# EAGLE design mimic4688 (EAGLE 7.5.0)
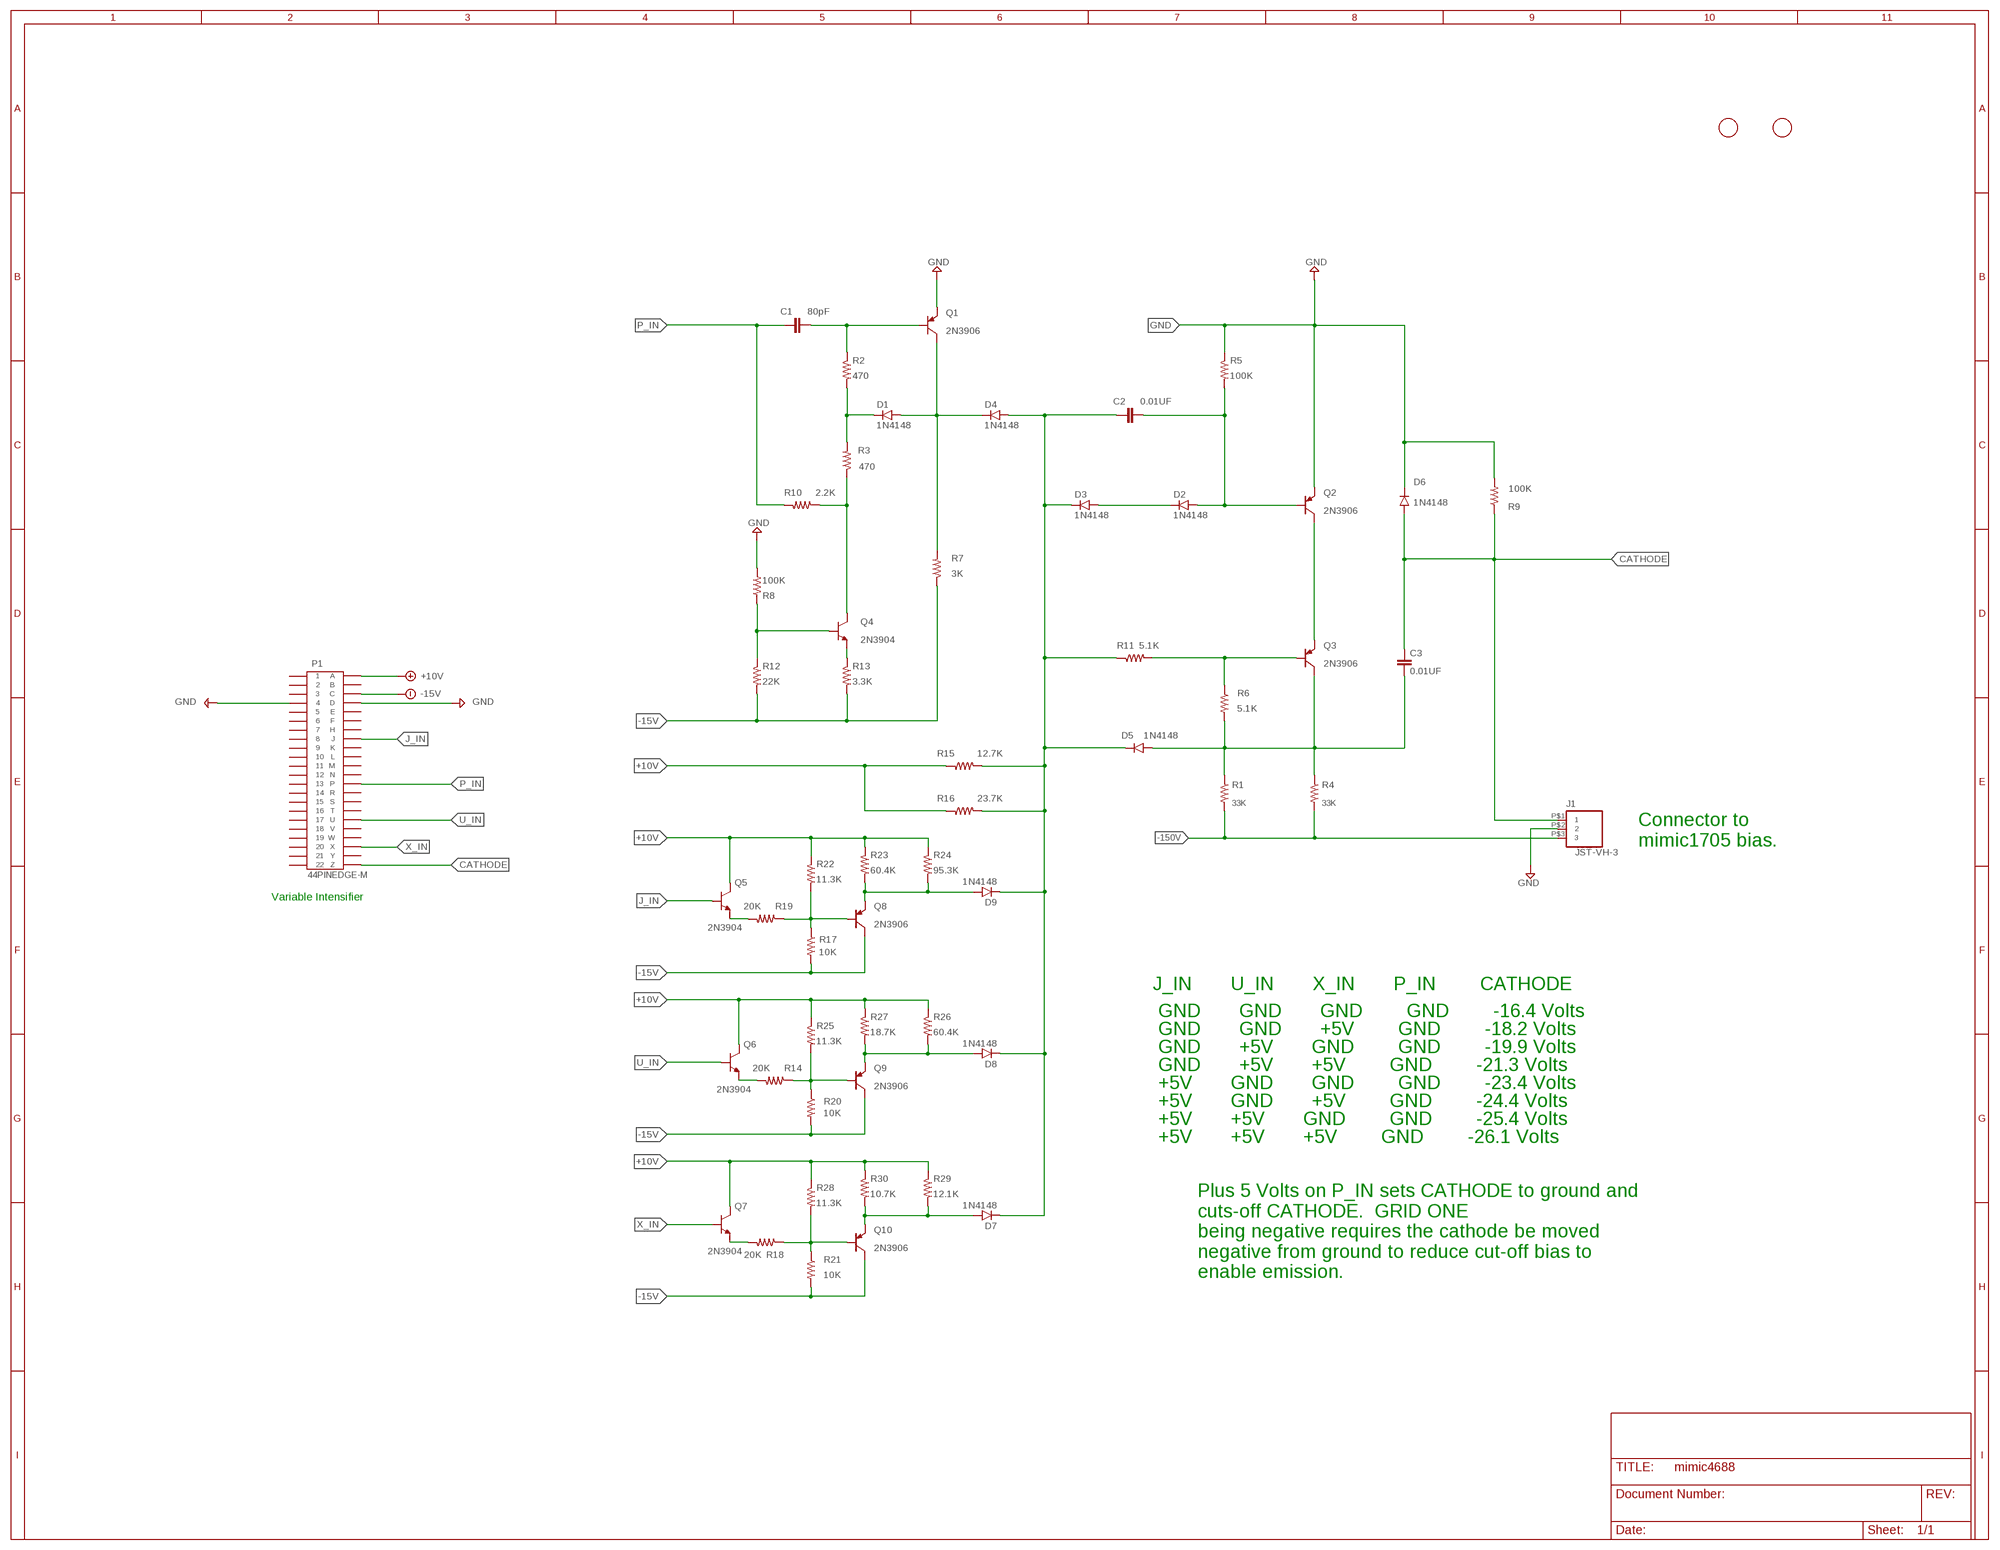
[diagram p0: schematic, sheet 1]

## Parts
C1  80pF  CAP_5MM  [5MM_TH]
C2  0.01UF  CAP_5MM  [5MM_TH]
C3  0.01UF  CAP_5MM  [5MM_TH]
D1  1N4148  [DO35-7]
D2  1N4148  [DO35-7]
D3  1N4148  [DO35-7]
D4  1N4148  [DO35-7]
D5  1N4148  [DO35-7]
D6  1N4148  [DO35-7]
D7  1N4148  [DO35-7]
D8  1N4148  [DO35-7]
D9  1N4148  [DO35-7]
J1  JST-VH-3  [VHR-3N]
P1  44PINEDGE-M  [44PINEDGE]
Q1  2N3906  [TO92]
Q2  2N3906  [TO92]
Q3  2N3906  [TO92]
Q4  2N3904  [TO92]
Q5  2N3904  [TO92]
Q6  2N3904  [TO92]
Q7  2N3904  [TO92]
Q8  2N3906  [TO92]
Q9  2N3906  [TO92]
Q10  2N3906  [TO92]
R1  33K  RES33K2W  [RR02]
R2  470  R-1/4WATT  [0207/10]
R3  470  R-1/4WATT  [0207/10]
R4  33K  RES33K2W  [RR02]
R5  100K  R-1/4WATT  [0207/10]
R6  5.1K  R-1/4WATT  [0207/10]
R7  3K  R-1/4WATT  [0207/10]
R8  100K  R-1/4WATT  [0207/10]
R9  100K  R-1/4WATT  [0207/10]
R10  2.2K  R-1/4WATT  [0207/10]
R11  5.1K  R-1/4WATT  [0207/10]
R12  22K  R-1/4WATT  [0207/10]
R13  3.3K  R-1/4WATT  [0207/10]
R14  20K  R-1/4WATT  [0207/10]
R15  12.7K  R-1/4WATT  [0207/10]
R16  23.7K  R-1/4WATT  [0207/10]
R17  10K  R-1/4WATT  [0207/10]
R18  20K  R-1/4WATT  [0207/10]
R19  20K  R-1/4WATT  [0207/10]
R20  10K  R-1/4WATT  [0207/10]
R21  10K  R-1/4WATT  [0207/10]
R22  11.3K  R-1/4WATT  [0207/10]
R23  60.4K  R-1/4WATT  [0207/10]
R24  95.3K  R-1/4WATT  [0207/10]
R25  11.3K  R-1/4WATT  [0207/10]
R26  60.4K  R-1/4WATT  [0207/10]
R27  18.7K  R-1/4WATT  [0207/10]
R28  11.3K  R-1/4WATT  [0207/10]
R29  12.1K  R-1/4WATT  [0207/10]
R30  10.7K  R-1/4WATT  [0207/10]
U$1  FIDUCIAL  [FIDUCIAL_1MM]
U$2  FIDUCIAL  [FIDUCIAL_1MM]

## Nets
+10V: P1.A Q5.3(C) Q6.3(C) Q7.3(C) R15.1 R16.1 R22.1 R23.1 R24.1 R25.1 R26.1 R27.1 R28.1 R29.1 R30.1
-15V: P1.C Q8.1(C) Q9.1(C) Q10.1(C) R7.1 R12.2 R13.2 R17.2 R20.2 R21.2
-150V: J1.P$3 R1.2 R4.2
CATHODE: C3.1 D6.A J1.P$1 P1.Z R9.1
GND: D6.C J1.P$2 P1.4 P1.D Q1.3(E) Q2.3(E) R5.1 R8.2 R9.2
J_IN: P1.J Q5.2(B)
N$1: C1.2 Q1.2(B) R2.1
N$2: Q9.2(B) R14.1 R20.1 R25.2
N$3: D8.A Q9.3(E) R26.2 R27.2
N$4: Q7.1(E) R18.2
N$5: Q10.2(B) R18.1 R21.1 R28.2
N$6: Q6.1(E) R14.2
N$7: D1.A D4.C Q1.1(C) R7.2
N$8: D1.C R2.2 R3.2
N$9: Q4.3(C) R3.1 R10.1
N$10: Q5.1(E) R19.2
N$11: Q4.1(E) R13.1
N$12: Q4.2(B) R8.1 R12.1
N$13: Q8.2(B) R17.1 R19.1 R22.2
N$14: D2.C D3.A
N$15: Q2.1(C) Q3.3(E)
N$16: D9.A Q8.3(E) R23.2 R24.2
N$17: D7.A Q10.3(E) R29.2 R30.2
N$18: Q3.2(B) R6.1 R11.2
N$20: C2.2 D2.A Q2.2(B) R5.2
N$21: C2.1 D3.C D4.A D5.C D7.C D8.C D9.C R11.1 R15.2 R16.2
P_IN: C1.1 P1.P R10.2
U_IN: P1.U Q6.2(B)
X_IN: P1.X Q7.2(B)
Y_OUT: C3.2 D5.A Q3.1(C) R1.1 R4.1 R6.2
Unconnected: P1.1 P1.2 P1.3 P1.5 P1.6 P1.7 P1.8 P1.9 P1.10 P1.11 P1.12 P1.13 P1.14 P1.15 P1.16 P1.17 P1.18 P1.19 P1.20 P1.21 P1.22 P1.B P1.E P1.F P1.H P1.K P1.L P1.M P1.N P1.R P1.S P1.T P1.V P1.W P1.Y

## Notes on the sheet
- Connector to 
  mimic1705 bias.
- Variable Intensifier
- J_IN       U_IN       X_IN       P_IN        CATHODE
- GND       GND       GND        GND        -16.4 Volts
- GND       GND       +5V        GND        -18.2 Volts
- GND       +5V       GND        GND        -19.9 Volts
- GND       +5V       +5V        GND        -21.3 Volts
- +5V       GND       GND        GND        -23.4 Volts
- +5V       GND       +5V        GND        -24.4 Volts
- +5V       +5V       GND        GND        -25.4 Volts
- +5V       +5V       +5V        GND        -26.1 Volts
- Plus 5 Volts on P_IN sets CATHODE to ground and
  cuts-off CATHODE.  GRID ONE 
  being negative requires the cathode be moved
  negative from ground to reduce cut-off bias to 
  enable emission.

## Library data of the parts
C1-C3 = keiths:CAP_5MM: Through hole radial, 5m pin spacing.
D1-D9 = keiths:1N4148: High Conductance Fast Diode
J1 = keiths:JST-VH-3: JST CONN HEADER VH SIDE 3POS 3.96MM
P1 = keiths:44PINEDGE-M: 44 PIN EDGE CONNECTOR FOR PCB
Q1-Q3 Q8-Q10 = keiths:2N3906: PNP Transistor
Q4-Q7 = keiths:2N3904: NPN Transistor
R1 R4 = keiths:RES33K2W: Metal Film Resistors - Through Hole 5% 33K TE Connectivity RR02J33KTB
R2 R3 R5-R30 = keiths:R-1/4WATT: Quarter watt through hole resistor.
U$1 U$2 = adafruit:FIDUCIAL: For use by pick and place machines to calibrate the vision/machine, 1mm By microbuilder.eu

## Board
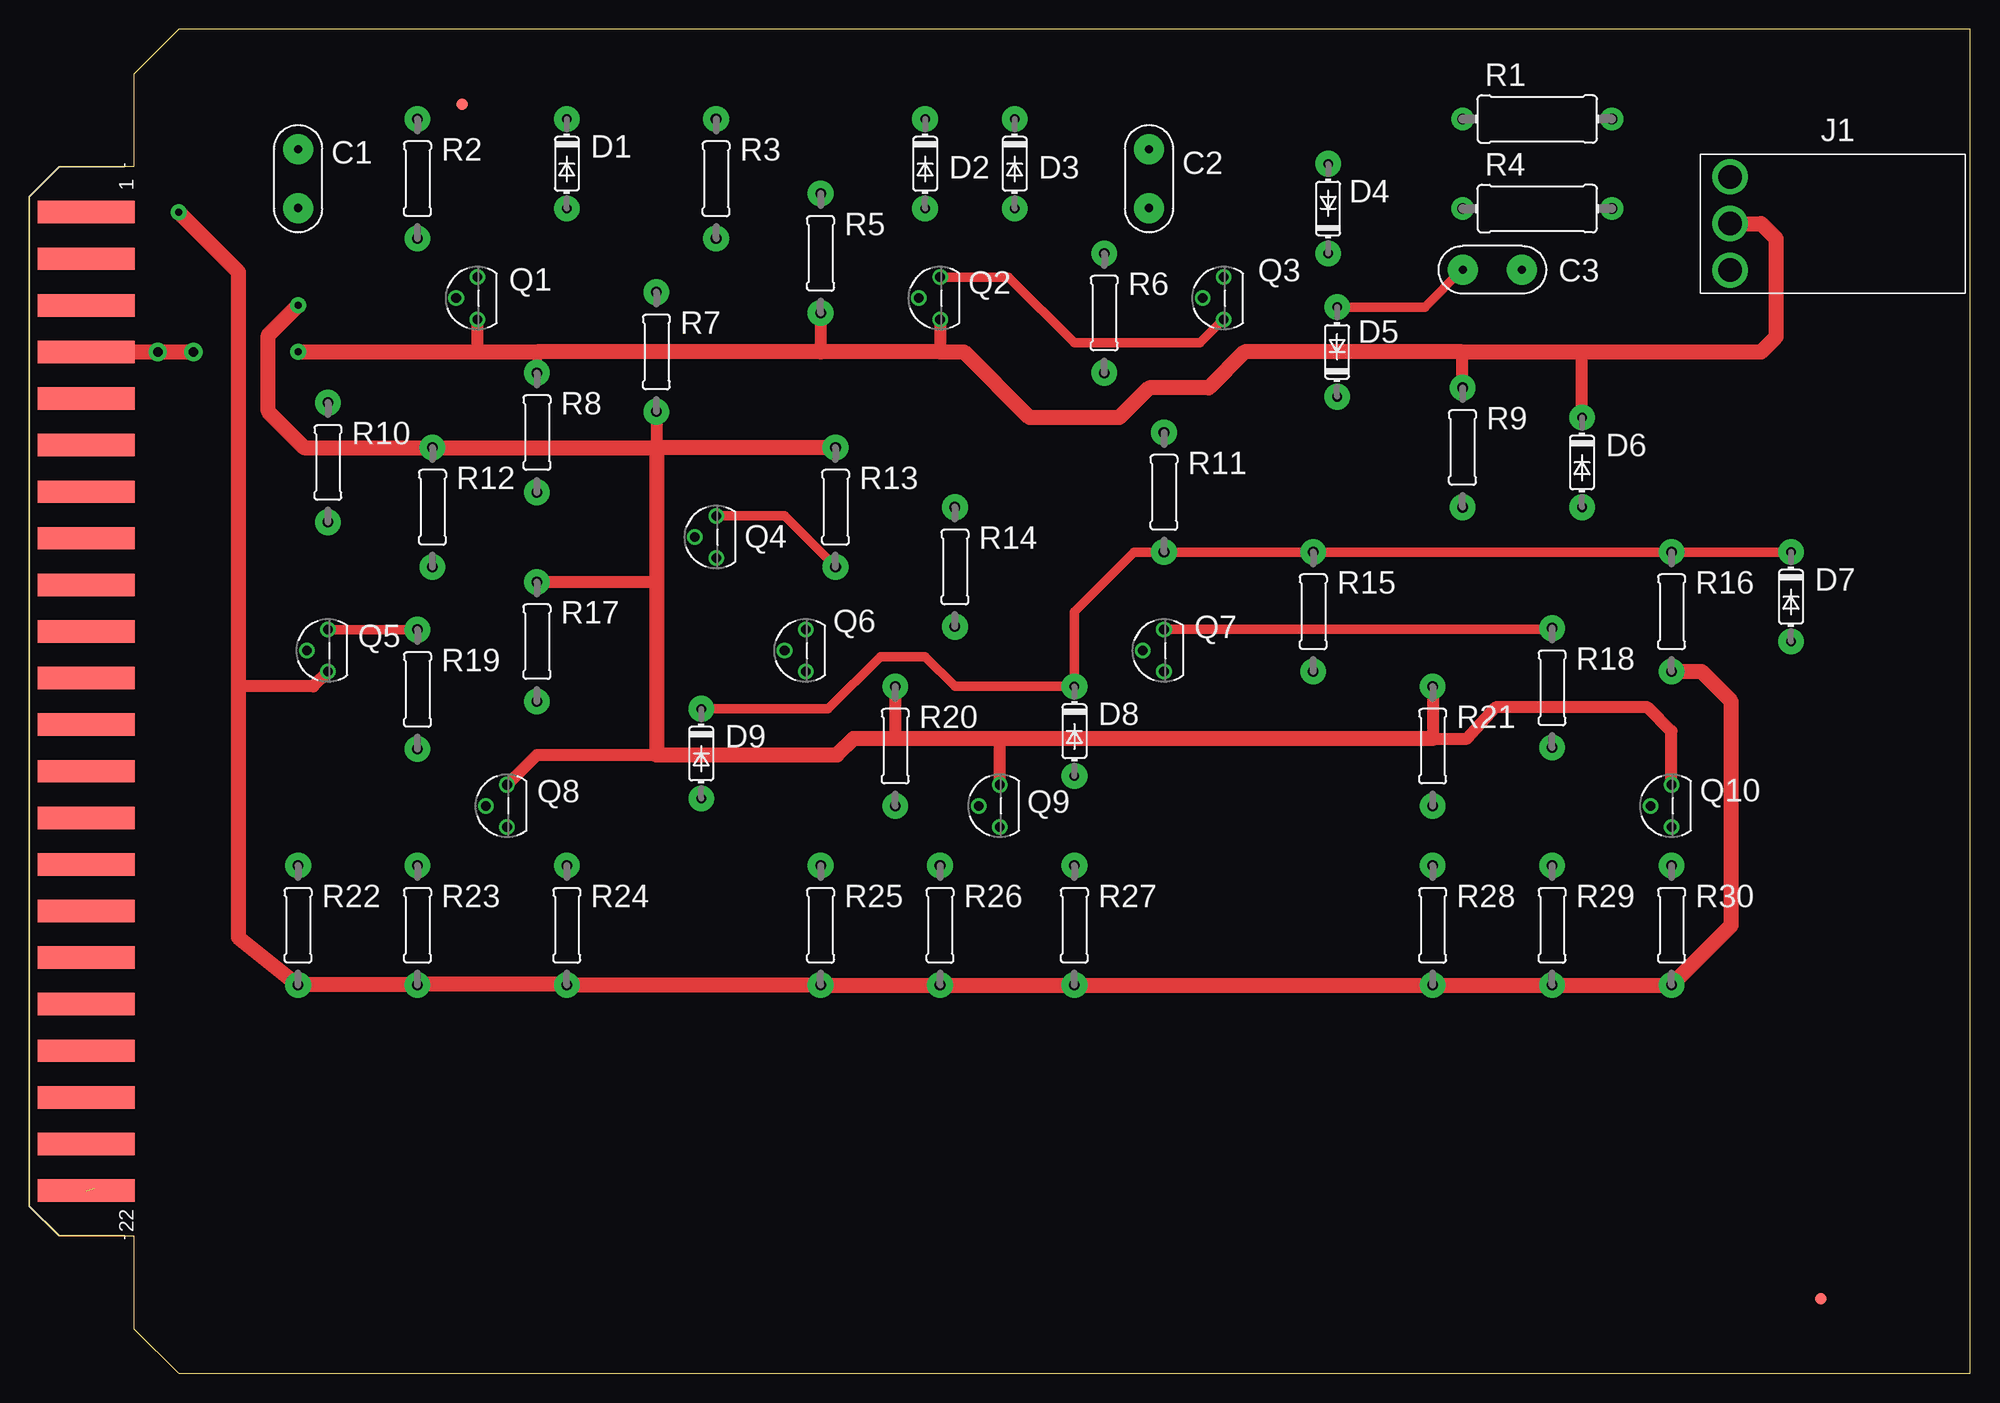
[diagram p1: board, top side]
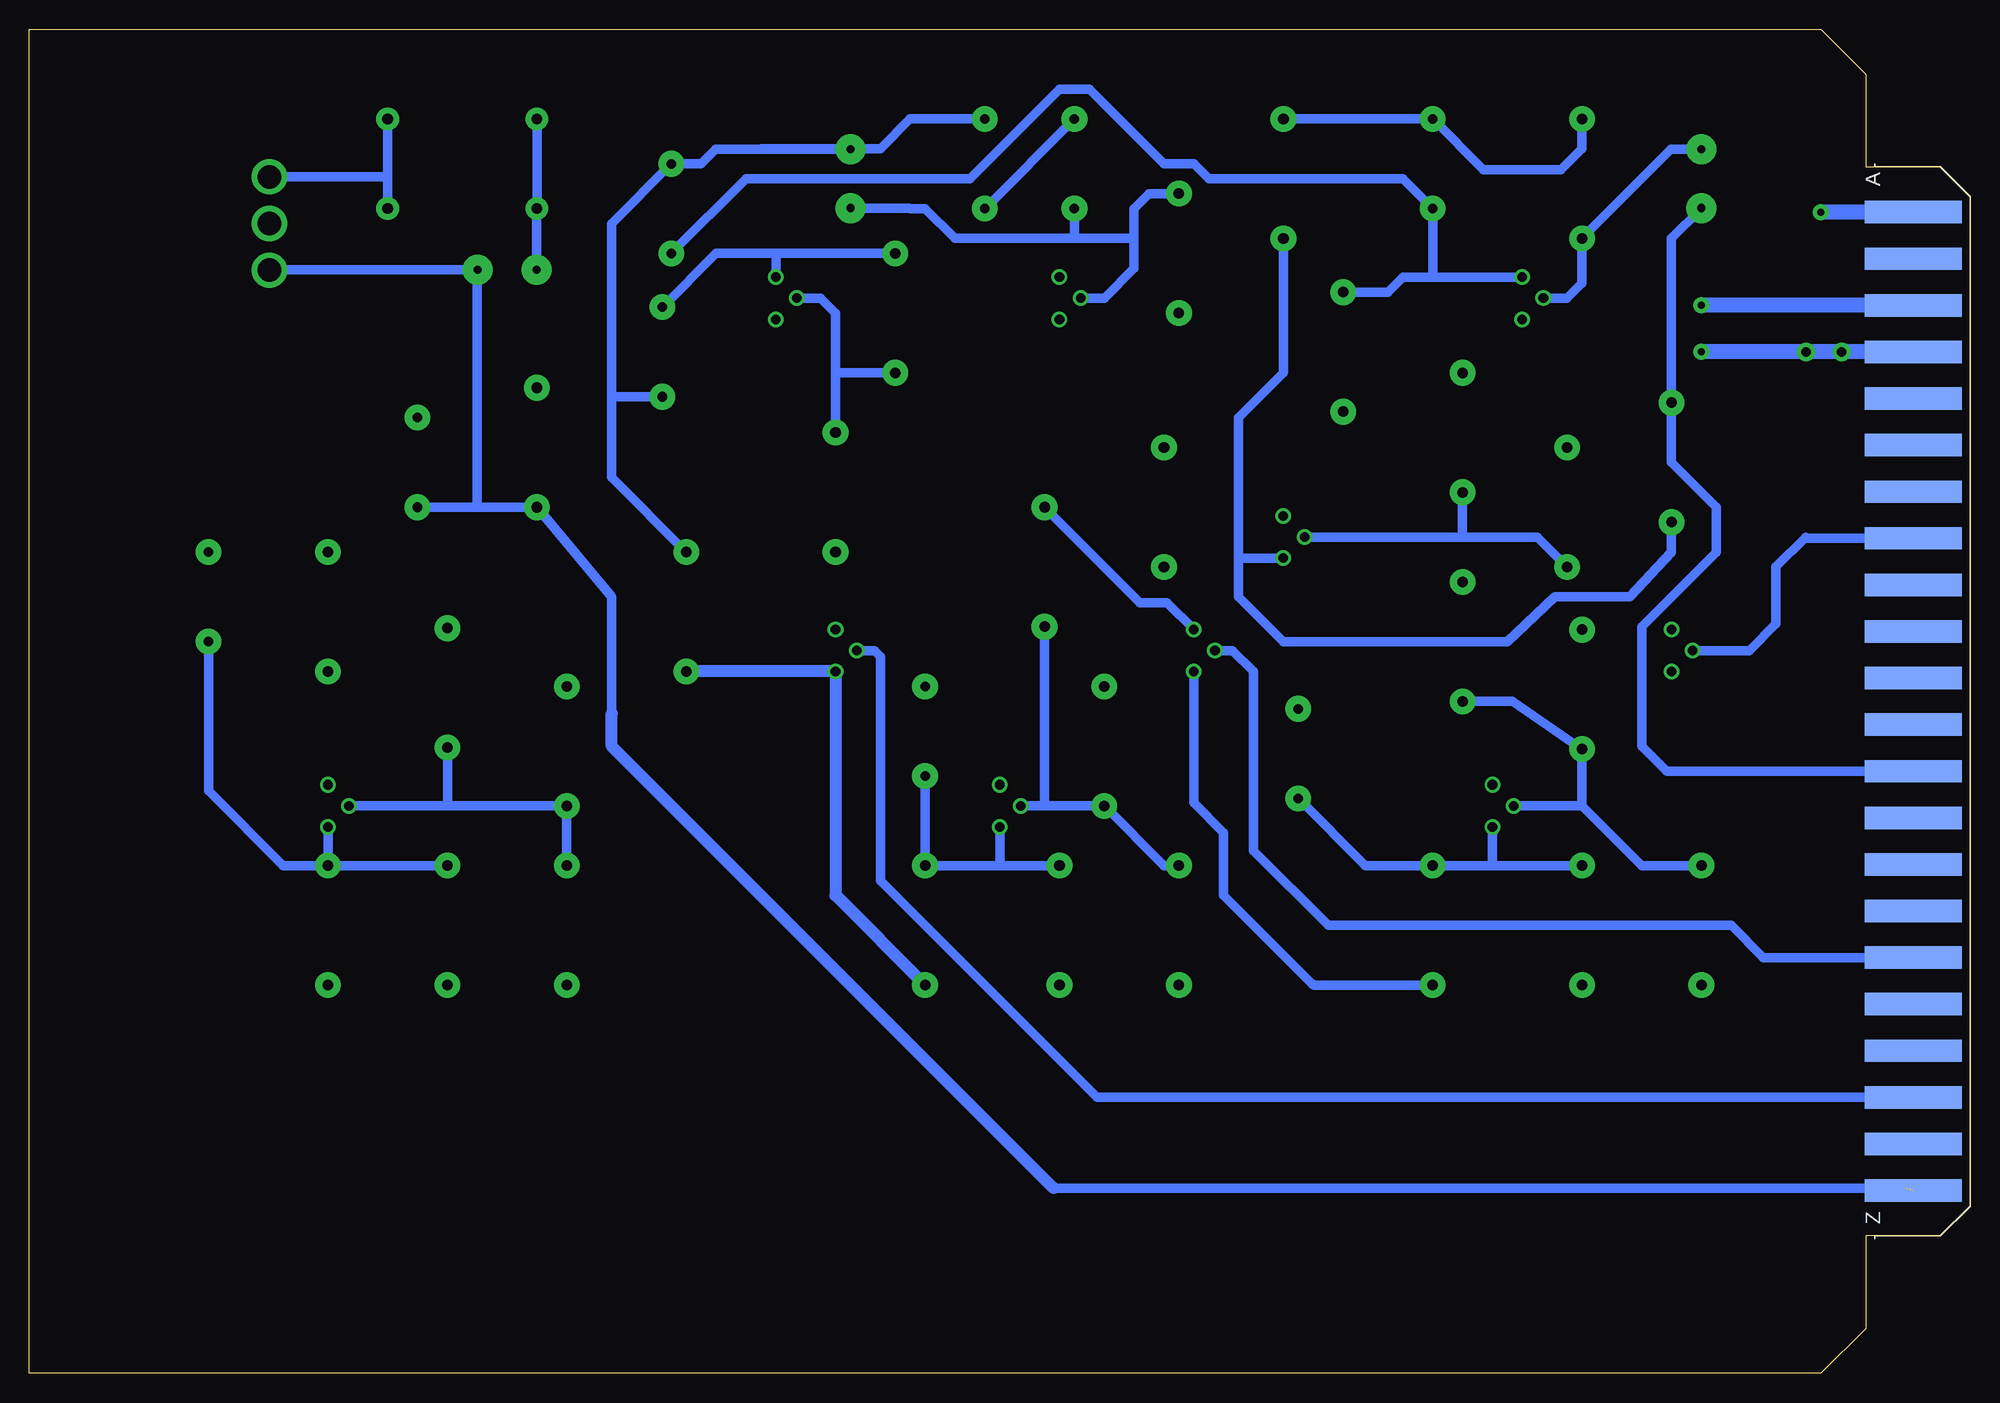
[diagram p2: board, bottom side, seen from below]

Size 165.1 x 114.3 mm. Coordinates in mm from the lower left corner, seen from the top.
Outline: 2.54,11.68 8.89,11.68 8.89,3.81 12.7,0 165.1,0 165.1,114.3 12.7,114.3 8.89,110.49 8.89,102.62 2.54,102.62 0,100.08 0,14.22 2.54,11.68
Copper layers (1*16): Top 0.035mm / dielectric 1.5mm / Bottom 0.035mm
Design rules "two_layer_th": minimum track width 32mil, minimum drill 22mil, track to track 20mil, track to pad 20mil, pad to pad 30mil, via to via 30mil, smd to smd 30mil, copper to edge 20mil, drill to drill 20mil, minimum pad ring 10mil, minimum via ring 15mil, stop-mask expansion 4mil, vias tented up to drill 0mil, thermal gap 10mil

### Footprints (pad centres in the part's own frame; a part is rotated, then mirrored left to right if it is on the bottom)
5MM_TH = drill 0.7 pad 2.54: 1 -2.5,0; 2 2.5,0
DO35-7 = drill 0.813 pad 2.184: A 0,-3.81; C 0,3.81
VHR-3N = drill 2: P$1 -9,-3.969; P$2 -9,0; P$3 -9,3.969
44PINEDGE = smd 1.905 x 8.255: 1 -41.605,4.826; 2 -37.643,4.826; 3 -33.68,4.826; 4 -29.718,4.826; 5 -25.756,4.826; 6 -21.793,4.826; 7 -17.831,4.826; 8 -13.868,4.826; 9 -9.906,4.826; 10 -5.944,4.826; 11 -1.981,4.826; 12 1.981,4.826; 13 5.944,4.826; 14 9.906,4.826; 15 13.868,4.826; 16 17.831,4.826; 17 21.793,4.826; 18 25.756,4.826; 19 29.718,4.826; 20 33.68,4.826; 21 37.643,4.826; 22 41.605,4.826 | smd 1.905 x 8.255 bottom: A -41.605,4.826; B -37.643,4.826; C -33.68,4.826; D -29.718,4.826; E -25.756,4.826; F -21.793,4.826; H -17.831,4.826; J -13.868,4.826; K -9.906,4.826; L -5.944,4.826; M -1.981,4.826; N 1.981,4.826; P 5.944,4.826; R 9.906,4.826; S 13.868,4.826; T 17.831,4.826; U 21.793,4.826; V 25.756,4.826; W 29.718,4.826; X 33.68,4.826; Y 37.643,4.826; Z 41.605,4.826
TO92 = drill 0.813: 1 1.27,-1.27; 2 1.27,1.27; 3 -1.27,1.27
RR02 = drill 0.914 pad 1.93: 1 -6.35,0; 2 6.35,0
0207/10 = drill 0.9 pad 2.184: 1 0,-5.08; 2 0,5.08
FIDUCIAL_1MM = smd 1 x 1: 1 0,0

### Placement (x,y rotation side)
C1  22.86,101.6 90 top
C2  95.25,101.6 270 top
C3  124.46,93.85 180 top
D1  45.72,102.87 0 top
D2  76.2,102.87 0 top
D3  83.82,102.87 0 top
D4  110.49,99.06 180 top
D5  111.25,86.87 180 top
D6  132.08,77.47 0 top
D7  149.86,66.04 0 top
D8  88.9,54.61 0 top
D9  57.15,52.7 0 top
J1  153.67,97.79 0 top
P1  0,57.15 270 top
Q1  38.1,91.44 135 top
Q2  77.47,91.44 135 top
Q3  101.6,91.44 135 top
Q4  58.42,71.12 135 top
Q5  25.4,61.47 135 top
Q6  66.04,61.47 135 top
Q7  96.52,61.47 135 top
Q8  40.64,48.26 135 top
Q9  82.55,48.26 135 top
Q10  139.7,48.26 135 top
R1  128.27,106.68 0 top
R2  33.02,101.6 0 top
R3  58.42,101.6 0 top
R4  128.27,99.06 0 top
R5  67.31,95.25 0 top
R6  91.44,90.17 0 top
R7  53.34,86.87 0 top
R8  43.18,80.01 0 top
R9  121.92,78.74 0 top
R10  25.4,77.47 0 top
R11  96.52,74.93 0 top
R12  34.29,73.66 0 top
R13  68.58,73.66 0 top
R14  78.74,68.58 0 top
R15  109.22,64.77 0 top
R16  139.7,64.77 0 top
R17  43.18,62.23 0 top
R18  129.54,58.29 0 top
R19  33.02,58.17 0 top
R20  73.66,53.34 0 top
R21  119.38,53.34 0 top
R22  22.86,38.1 0 top
R23  33.02,38.1 0 top
R24  45.72,38.1 0 top
R25  67.31,38.1 0 top
R26  77.47,38.1 0 top
R27  88.9,38.1 0 top
R28  119.38,38.1 0 top
R29  129.54,38.1 0 top
R30  139.7,38.1 0 top
U$1  36.83,107.95 0 top
U$2  152.4,6.35 0 top

### Tracks (layer width: path | path; a pad name or v marks a point on that pad's centre or on a via)
+10V  (via drill 0.6)
  Top 0.813: 22.84,33.07 R22.1 | 32.28,33.07 R23.1 33.07,33.07 | 46.46,33.07 R24.1 45.67,33.07
  Top 1.016: 23.62,33.07 R22.1 | Q5.3 24.15,58.42 17.78,58.42
  Top 1.27: 23.62,33.07 32.28,33.07 | 45.67,33.07 33.07,33.07 | R24.1 R25.1 R26.1 R27.1 R28.1 R29.1 R30.1 144.78,38.1 144.78,57.15 142.24,59.69 R16.1 | v12.7,98.75 17.78,93.67 17.78,58.42 17.78,37.08 R22.1
  Bottom 0.813: 46.46,33.07 R24.1 55.83,33.02 55.88,33.07 55.93,33.07 63.5,40.64 63.5,45.97 66.04,48.51 Q6.3
  Bottom 1.016: R27.1 96.52,40.64 Q7.3 96.54,59.69 R15.1
  Bottom 1.27: P1.A v12.7,98.75
-15V  (via drill 0.6)
  Top 1.016: Q8.1 43.18,52.6 53.34,52.6 | Q9.1 82.55,53.98 | Q10.1 139.7,54.61 137.67,56.64 124.71,56.64 122.3,53.98 119.38,53.98 R21.2 | R7.1 53.34,78.74 | R17.2 53.34,67.31 | R20.2 73.66,53.98
  Top 1.27: 53.34,78.74 53.34,67.31 53.34,52.6 68.72,52.6 70.1,53.98 73.66,53.98 82.55,53.98 119.38,53.98 | R13.2 53.34,78.74 | 53.34,78.74 R12.2 23.37,78.74 20.32,81.79 20.32,88.29 v22.86,90.83
  Bottom 1.27: P1.C v22.86,90.83
-150V
  Bottom 0.813: R1.2 134.62,101.6 | 134.62,101.6 R4.2 | J1.P$3 134.78,101.76 134.62,101.6
CATHODE  (1 unrouted)
  Bottom 0.813: 77.98,15.75 5.51,15.75 | D6.A 127,73.66 | 127,73.66 R9.1 115.57,66.04 115.57,56.13 | 127,73.66 127,92.67 C3.1 144.64,93.85 J1.P$1
  Bottom 1.016: 77.98,15.75 115.57,53.34 115.57,56.13
GND  (via drill 0.6, 0.8)
  Top 0.813: R8.2 43.18,86.87
  Top 1.016: R9.2 121.92,86.87 | D6.C 132.08,86.87 | Q1.3 38.1,86.87 | Q2.3 77.47,86.87 | R5.1 67.31,86.87
  Top 1.27: v22.86,86.87 38.1,86.87 43.18,86.87 67.31,86.87 77.47,86.87 79.5,86.87 85.09,81.28 92.71,81.28 95.25,83.82 100.33,83.82 103.38,86.87 121.92,86.87 132.08,86.87 147.32,86.87 148.59,88.14 148.59,96.52 147.32,97.79 J1.P$2 | P1.4 v10.92,86.87 v13.97,86.87
  Bottom 1.27: P1.4 v10.92,86.87 v13.97,86.87 v22.86,86.87
J_IN
  Bottom 0.813: Q5.2 18.8,61.47 16.51,63.75 16.51,68.58 13.97,71.12 13.87,71.02 P1.J
N$1
  Bottom 0.813: Q1.2 34.29,91.44 33.02,92.71 R2.1 25.44,104.1 C1.2
N$2
  Bottom 0.813: 78.74,48.26 Q9.2 | R25.2 68.58,43.18 R20.1 78.74,48.26 | R14.1 78.74,48.26
N$3
  Bottom 0.813: 82.55,43.18 R27.2 D8.A | 82.55,43.18 R26.2 | Q9.3 82.55,43.18
N$4
  Top 0.813: Q7.1 129.43,63.26 R18.2
N$5
  Bottom 0.813: Q10.2 129.54,48.26 | R18.1 129.54,48.26 | R28.2 R21.1 129.54,48.26
N$6
  Bottom 0.813: R14.2 70.61,65.53 68.31,65.53 Q6.1
N$7
  Bottom 0.813: 45.72,93.24 48.26,93.24 49.55,91.95 R7.2 | 45.72,93.24 Q1.1 | 45.72,93.24 D1.A 48.26,101.6 64.77,101.6 66.04,102.87 68.58,102.87 74.93,109.22 77.47,109.22 85.09,101.6 104.14,101.6 D4.C
N$8
  Bottom 0.813: R3.2 D1.C 41.4,102.36 34.8,102.36 33.02,104.14 R2.2
N$9
  Bottom 0.813: 62.23,69.32 62.23,66.04 58.42,62.23 39.37,62.23 35.31,66.04 28.96,66.04 25.4,69.85 R10.1 | 62.23,69.32 62.23,81.28 58.42,85.09 R3.1 | Q4.3 62.23,69.32
N$10
  Top 0.813: Q5.1 25.42,63.25 R19.2
N$11
  Top 0.813: Q4.1 64.24,72.92 R13.1
N$12
  Bottom 0.813: Q4.2 43.18,71.12 | 43.18,71.12 36.83,71.12 R12.1 | R8.1 43.18,71.12
N$13
  Bottom 0.813: R22.2 27.94,43.18 33.02,48.26 | Q8.2 33.02,48.26 | 33.02,48.26 R19.1 38.94,57.15 R17.1
N$14
  Bottom 0.813: D2.C D3.A
N$15
  Top 0.813: Q2.1 83.29,93.24 88.9,87.63 99.59,87.63 Q3.3
N$16
  Bottom 0.813: D9.A 51.44,43.18 R24.2 40.64,43.18 | 40.64,43.18 R23.2 | Q8.3 40.64,43.18
N$17
  Bottom 0.813: R30.2 143.51,43.18 149.86,49.53 D7.A | R29.2 R30.2 | Q10.3 R30.2
N$18
  Bottom 0.813: Q3.2 97.79,91.44 96.52,90.17 96.52,85.09 | R11.2 96.52,85.09 | R6.1 96.52,85.09
N$20
  Bottom 0.813: C2.2 90.21,99.1 90.17,99.06 88.9,99.06 86.36,96.52 76.2,96.52 | 76.2,96.52 71.12,96.52 | R5.2 69.85,100.33 71.12,99.06 71.12,96.52 | Q2.2 73.66,91.44 71.12,93.98 71.12,96.52 | D2.A 76.2,96.52
N$21
  Top 0.813: D9.C 67.94,56.52 72.39,60.96 76.2,60.96 78.74,58.42 D8.C 88.9,64.77 93.98,69.85 R11.1 R15.2 R16.2 D7.C
  Bottom 0.813: 115.57,83.31 115.57,76.2 R15.2 | 115.57,83.31 115.57,97.79 D4.A 107.95,102.87 106.72,104.1 C2.1 101.64,104.14 | D3.C 90.17,106.68 92.71,104.14 101.64,104.14 | 102.87,104.14 101.64,104.14 | D5.C 115.32,83.06 115.57,83.31
P_IN
  Bottom 0.813: C1.1 22.86,99.06 25.4,96.52 R10.2 | R10.2 25.4,77.47 21.59,73.66 21.59,69.85 27.94,63.5 27.94,53.34 25.81,51.21 P1.P | 25.76,82.55 R10.2
U_IN
  Bottom 0.813: Q6.2 62.74,61.47 60.96,59.69 60.96,44.45 54.61,38.1 20.32,38.1 17.58,35.36 P1.U
X_IN
  Bottom 0.813: Q7.2 93.22,61.47 92.71,60.96 92.71,41.91 74.27,23.47 P1.X
Y_OUT
  Top 0.813: C3.2 121.88,93.85 118.7,90.68 D5.A
  Bottom 0.813: R1.1 R4.1 121.96,99.02 C3.2 | 101.6,95.25 106.68,95.25 D5.A | Q3.1 101.6,95.25 | R6.2 101.6,95.25

### Text on the board
logo: board type 4688 / variable intensifier